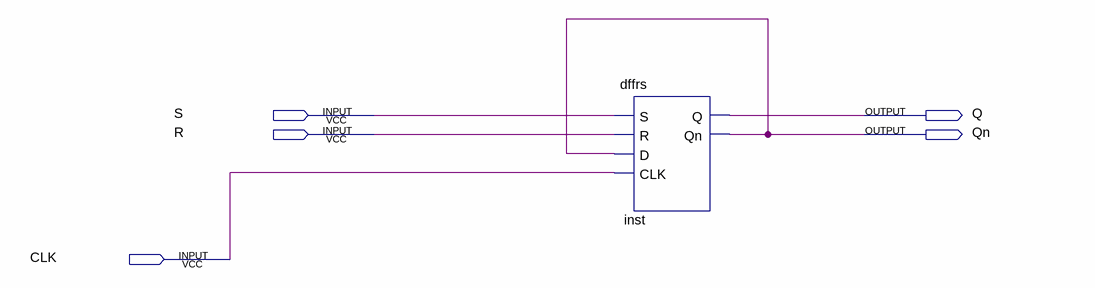
[diagram p0: schematic sheet]
// Quartus schematic freqdiv2.bdf as structural Verilog: 1 symbols, 5 pins
module freqdiv2 (
  input  S,
  input  R,
  input  CLK,
  output Q,
  output Qn
);

  dffrs inst (.S(S), .R(R), .D(Qn), .CLK(CLK), .Q(Q), .Qn(Qn));
endmodule
